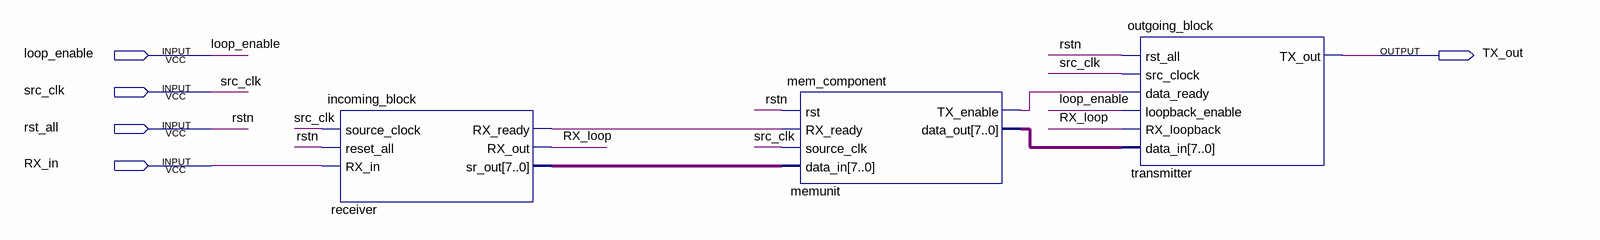
[diagram p0: schematic sheet]
// Quartus schematic rs232_project.bdf as structural Verilog: 3 symbols, 5 pins
module rs232_project (
  input  loop_enable,
  input  src_clk,
  input  rst_all,
  input  RX_in,
  output TX_out
);

  wire memunit_tx_enable, receiver_rx_ready, RX_loop;
  wire [7:0] memunit_data_out, receiver_sr_out;

  incoming_block receiver (
    .source_clock(src_clk), .reset_all(rst_all), .RX_in(RX_in), .RX_ready(receiver_rx_ready),
    .RX_out(RX_loop), .sr_out(receiver_sr_out));
  mem_component memunit (
    .rst(rst_all), .RX_ready(receiver_rx_ready), .source_clk(src_clk), .data_in(receiver_sr_out),
    .TX_enable(memunit_tx_enable), .data_out(memunit_data_out));
  outgoing_block transmitter (
    .rst_all(rst_all), .src_clock(src_clk), .data_ready(memunit_tx_enable), .loopback_enable(loop_enable),
    .RX_loopback(RX_loop), .data_in(memunit_data_out), .TX_out(TX_out));

  // Other names for the same wires on the sheet: rstn = rst_all
endmodule
